# EAGLE design untitled (EAGLE 6.3)
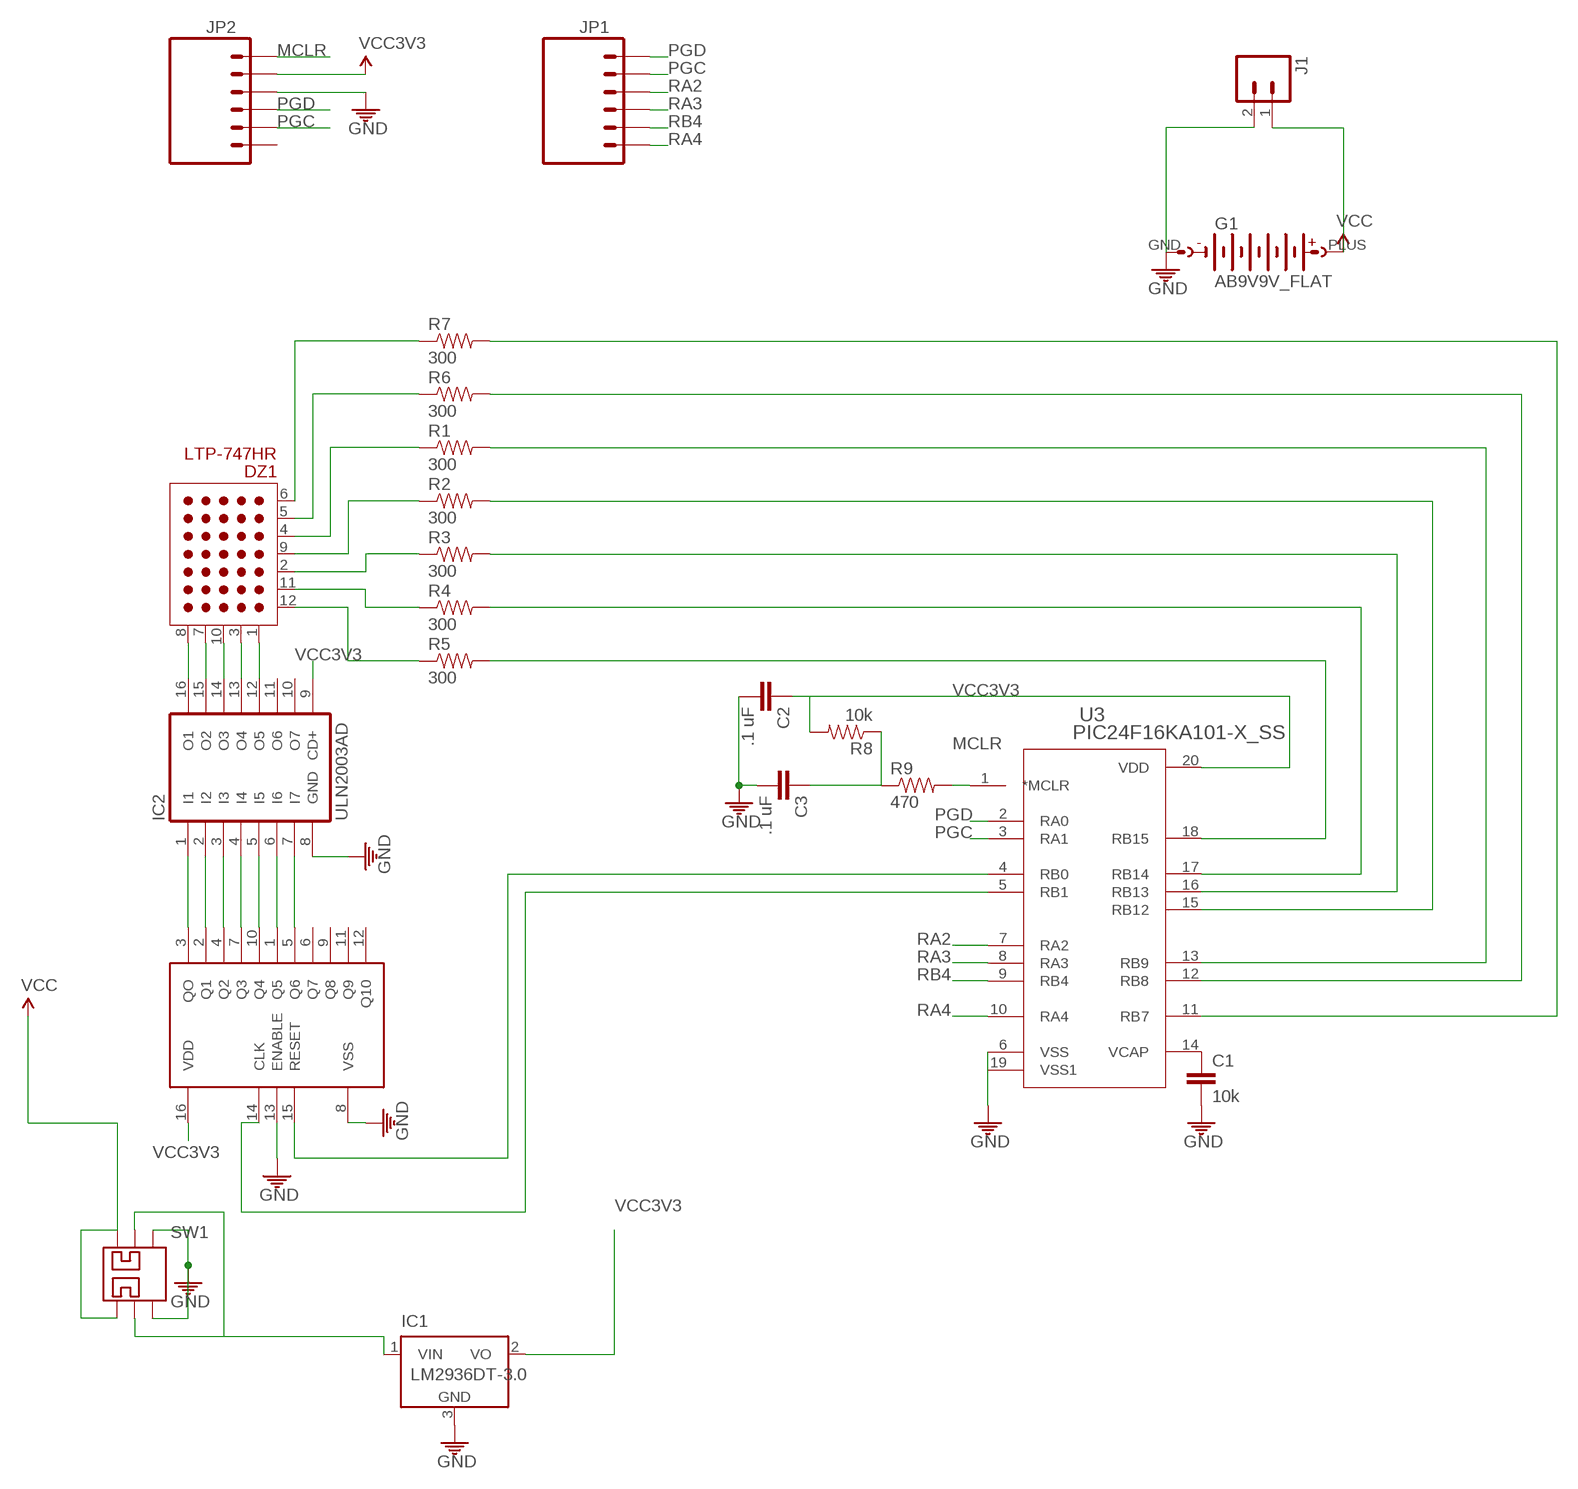
[diagram p0: schematic, sheet 1]

## Parts
C1  10k  CAP1206  [1206]
C2  .1 uF  CAP1206  [1206]
C3  .1 uF  CAP1206  [1206]
DZ1  LTP-747HR  [LTP-747HR]
G1  AB9V9V_FLAT  [BH9VPC]
IC1  LM2936DT-3.0  [TO252]
IC2  ULN2003AD  [SO16]
J1  M02PTH  [1X02]
JP1  M06LOCK  [1X06_LOCK]
JP2  M06LOCK  [1X06_LOCK]
R1  300  RESISTOR0805-RES  [0805]
R2  300  RESISTOR0805-RES  [0805]
R3  300  RESISTOR0805-RES  [0805]
R4  300  RESISTOR0805-RES  [0805]
R5  300  RESISTOR0805-RES  [0805]
R6  300  RESISTOR0805-RES  [0805]
R7  300  RESISTOR0805-RES  [0805]
R8  10k  RESISTOR0805-RES  [0805]
R9  470  RESISTOR0805-RES  [0805]
SW1  SLIDE_SWITCH_DPDTTOP  [EG2207]
U1  MC14017B  [SO16]
U3  PIC24F16KA101-X_SS  [SSOP20_MC]

## Nets
GND: C1.2 C2.2 C3.2 G1.GND(-) IC1.3(GND) IC2.8(GND) J1.2 JP2.3 SW1.P$3 SW1.P$6 U1.8(VSS) U1.13(ENABLE) U3.6(VSS) U3.19(VSS1)
MCLR: JP2.1 R9.2 U3.1(*MCLR)
N$1: DZ1.8(C5) IC2.16(O1)
N$2: DZ1.7(C4) IC2.15(O2)
N$3: DZ1.10(C3) IC2.14(O3)
N$4: DZ1.3(C2) IC2.13(O4)
N$5: DZ1.1(C1) IC2.12(O5)
N$6: IC2.1(I1) U1.3(QO)
N$7: IC2.2(I2) U1.2(Q1)
N$8: IC2.3(I3) U1.4(Q2)
N$9: IC2.4(I4) U1.7(Q3)
N$10: IC2.5(I5) U1.10(Q4)
N$11: IC2.6(I6) U1.1(Q5)
N$12: IC2.7(I7) U1.5(Q6)
N$13: U1.15(RESET) U3.4(RB0)
N$14: U1.14(CLK) U3.5(RB1)
N$16: DZ1.6(R7) R7.1
N$17: C1.1 U3.14(VCAP)
N$18: DZ1.5(R6) R6.1
N$19: DZ1.4(R5) R1.1
N$20: DZ1.9(R4) R2.1
N$21: DZ1.2(R3) R3.1
N$22: DZ1.11(R2) R4.1
N$23: DZ1.12(R1) R5.1
N$24: IC1.1(VIN) SW1.P$2 SW1.P$5
N$25: R5.2 U3.18(RB15)
N$26: R4.2 U3.17(RB14)
N$27: R3.2 U3.16(RB13)
N$28: R2.2 U3.15(RB12)
N$29: R1.2 U3.13(RB9)
N$30: R6.2 U3.12(RB8)
N$31: R7.2 U3.11(RB7)
N$32: C3.1 R8.1 R9.1
PGC: JP1.2 JP2.5 U3.3(RA1)
PGD [small]: JP1.1 JP2.4 U3.2(RA0)
RA2: JP1.3 U3.7(RA2)
RA3: JP1.4 U3.8(RA3)
RA4: JP1.6 U3.10(RA4)
RB4: JP1.5 U3.9(RB4)
VCC: G1.PLUS(+) J1.1 SW1.P$1 SW1.P$4
VCC3V3 [power]: C2.1 IC1.2(VO) IC2.9(CD+) JP2.2 R8.2 U1.16(VDD) U3.20(VDD)
Unconnected: IC2.10(O7) IC2.11(O6) JP2.6 U1.6(Q7) U1.9(Q8) U1.11(Q9) U1.12(Q10)

## Library data of the parts
C1-C3 = ASL:CAP: Capacitor Standard 0603 ceramic capacitor, and 0.1" leaded capacitor.
DZ1 = ledmatrix:LTP-747HR: 5x7 Dot Matrix LED Display
G1 = ASL:AB9V: 9-V BATTERY CLIP
IC1 = national-semiconductor:LM2936?*: Ultra-Low Quiescent Current LDO Voltage Regulator Source: Data sheet <http://www.national.com/ds/LM/LM2936.pdf>; MF: NATIONAL SEMICONDUCTOR; MPN: LM2936DT-3.0; OC_FARNELL: 1286862; OC_NEWARK: 74C4101
IC2 = uln-udn:ULN2003A: DRIVER ARRAY
J1 = ASL:M02: Header 2 Standard 2-pin 0.1" header. Use with straight break away headers (SKU : PRT-00116), right angle break away headers (PRT-00553), swiss pins (PRT-00743), machine pins (PRT-00117), and female headers (PRT-00115). Molex polarized connector foot print use with SKU : PRT-08233 with associated crimp pins and housings.
JP1 JP2 = CMPE118lib:M06: Header 6 Standard 6-pin 0.1" header. Use with straight break away headers (SKU : PRT-00116), right angle break away headers (PRT-00553), swiss pins (PRT-00743), machine pins (PRT-00117), and female headers (PRT-00115). Molex polarized connector foot print use with SKU : PRT-08094 with associated crimp pins and housings. NOTES ON THE VARIANTS LOCK and LOCK_LONGPADS... This footprint was designed to help hold the alignment of a through-hole component (i.e. 6-pin header) while soldering it into place. You may notice that each hole has been shifted either up or down by 0.005 of an inch from it's more standard position (which is a perfectly straight line). This slight alteration caused the pins (the squares in the middle) to touch the edges of the holes. Because they are alternating, it causes a "brace" to hold the component in place. 0.005 has proven to be the perfect amount of "off-center" position when using our standard breakaway headers. Although looks a little odd when you look at the bare footprint, once you have a header in there, the alteration is very hard to notice. Also, if you push a header all the way into place, it is covered up entirely on the bottom side. This idea of altering the position of holes to aid alignment will be further integrated into the Sparkfun Library for other footprints. It can help hold any component with 3 or more connection pins.
R1-R9 = ASL:RESISTOR: Resistor Basic schematic elements and footprints for 0603, 1206, and PTH resistors.
SW1 = ASL:SLIDE_SWITCH_DPDT
U1 = BadgeStuff:MC14017B
U3 = BadgeStuff:PIC24F16KA101-X_SS

## Net classes
0 default: width 0.406 mm
1 power: width 0.762 mm, clearance 0.254 mm to class 0, clearance 0.508 mm
2 small: width 0.254 mm, clearance 0.254 mm to class 1

## Board
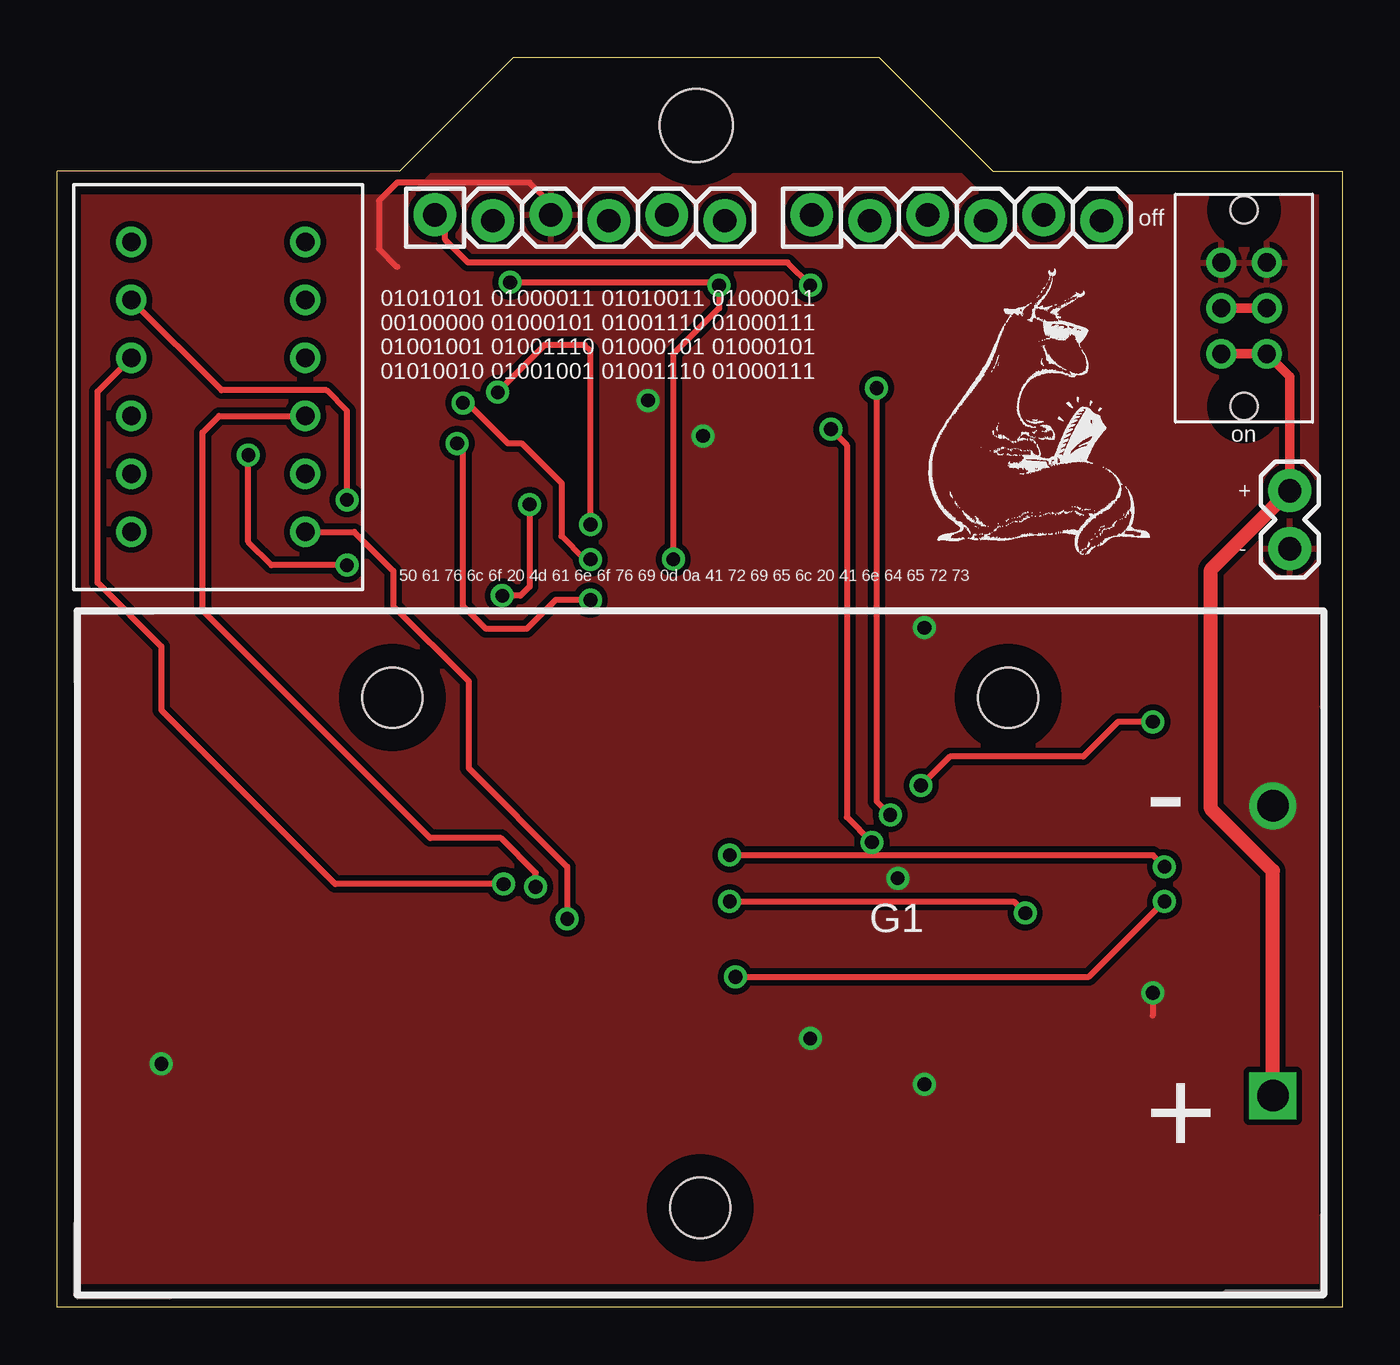
[diagram p1: board, top side]
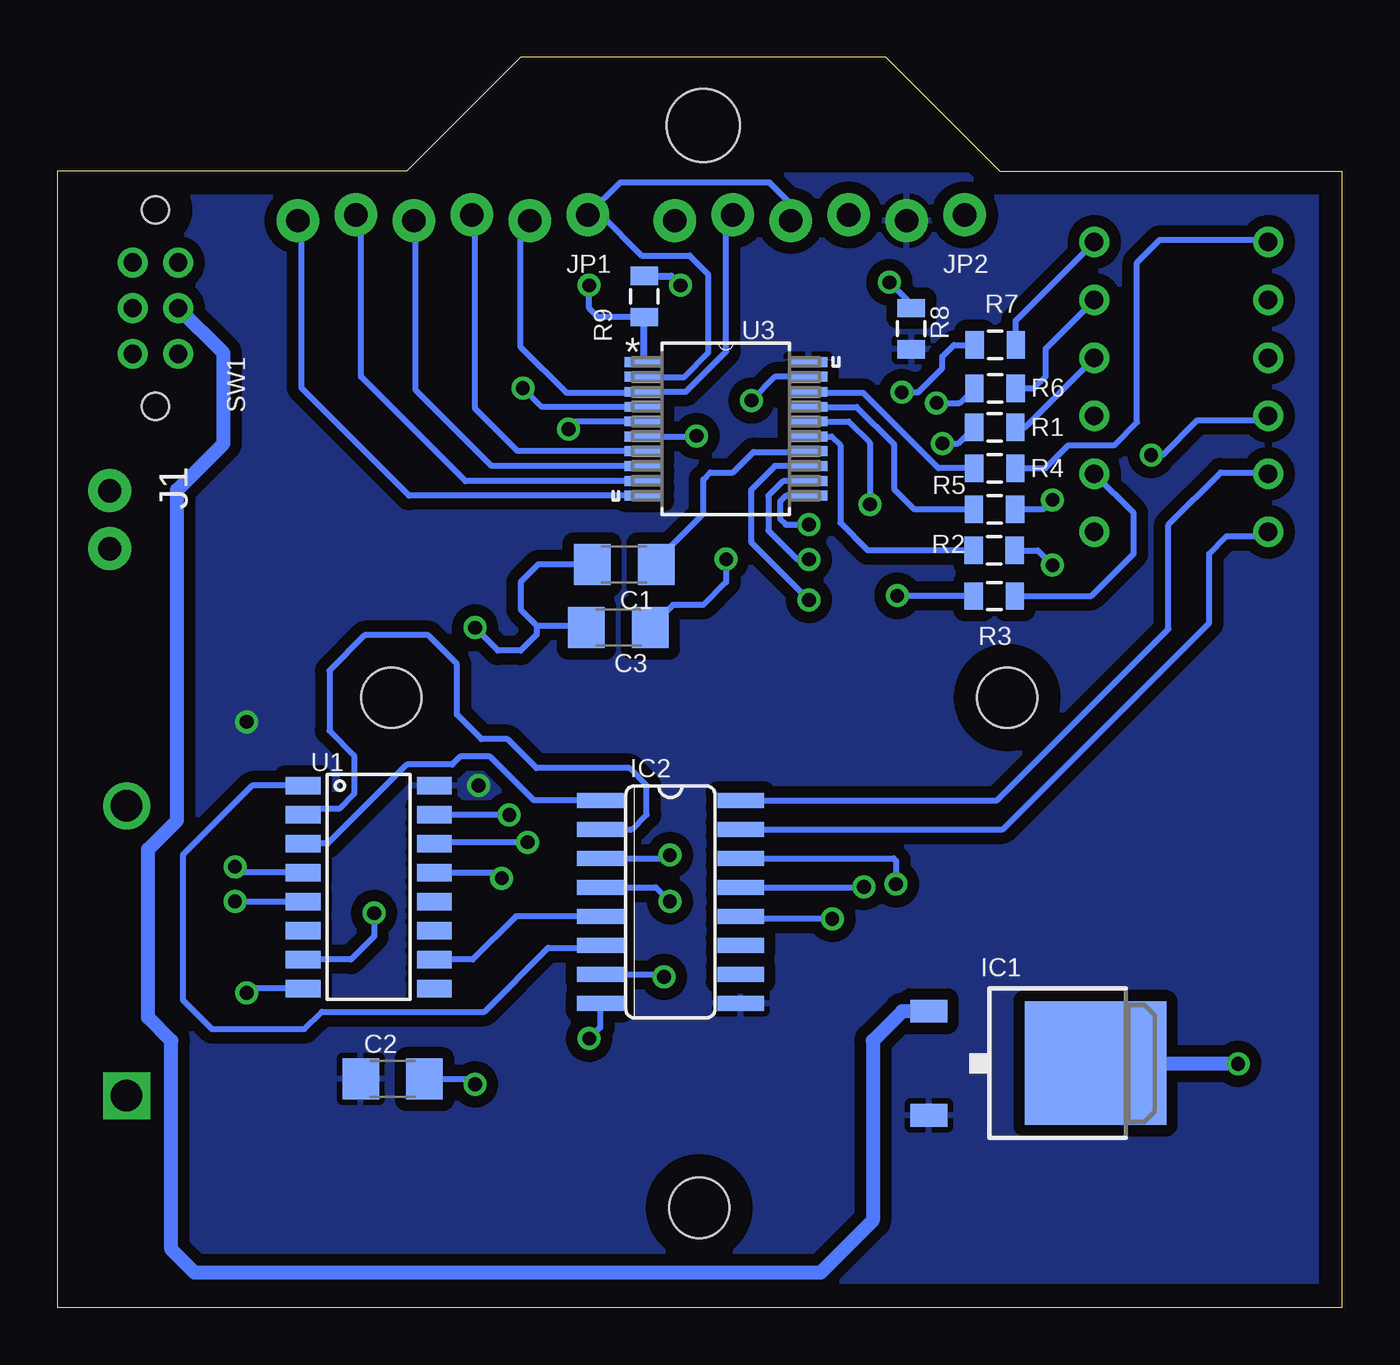
[diagram p2: board, bottom side, seen from below]

Size 56.31 x 54.78 mm. Coordinates in mm from the lower left corner, seen from the top.
Outline: 15,49.78 20,54.78 36,54.78 41,49.78 56.31,49.78 56.31,0 0,0 0,49.78 15,49.78
Copper layers (1*16): Top 0.035mm / dielectric 1.5mm / Bottom 0.035mm
Design rules "default": minimum track width 10mil, minimum drill 24mil, track to track 8mil, track to pad 8mil, pad to pad 8mil, via to via 8mil, smd to smd 8mil, copper to edge 40mil, drill to drill 8mil, minimum pad ring 10mil, minimum via ring 8mil, stop-mask expansion 4mil, vias tented up to drill 0mil, thermal gap 10mil
Holes 3.2 mm at 28,51.78

### Footprints (pad centres in the part's own frame; a part is rotated, then mirrored left to right if it is on the bottom)
1206 = smd 1.6 x 1.8: 1 -1.4,0; 2 1.4,0
LTP-747HR = drill 0.813: 1 -3.81,6.35; 2 -3.81,3.81; 3 -3.81,1.27; 4 -3.81,-1.27; 5 -3.81,-3.81; 6 -3.81,-6.35; 7 3.81,6.35; 8 3.81,3.81; 9 3.81,1.27; 10 3.81,-1.27; 11 3.81,-3.81; 12 3.81,-6.35
BH9VPC = drill 1.372: GND 24.3,5.42 | drill 1.372 square: PLUS 24.3,-7.28 | hole 2.642: 12.7,10.16; -14.275,10.16; -0.787,-12.192
TO252 = smd 1 x 1.6: 1 -2.28,-4.8; 2 2.28,-4.8 | smd 5.4 x 6.2: 3 0,2.5
SO16 = smd 0.66 x 2.032: 1 -4.445,-3.073; 2 -3.175,-3.073; 3 -1.905,-3.073; 4 -0.635,-3.073; 5 0.635,-3.073; 6 1.905,-3.073; 7 3.175,-3.073; 8 4.445,-3.073; 9 4.445,3.073; 10 3.175,3.073; 11 1.905,3.073; 12 0.635,3.073; 13 -0.635,3.073; 14 -1.905,3.073; 15 -3.175,3.073; 16 -4.445,3.073
1X02 = drill 1.016 pad 1.88: 1 0,0; 2 2.54,0
1X06_LOCK = drill 1.016 pad 1.88: 1 0,0.127; 2 2.54,-0.127; 3 5.08,0.127; 4 7.62,-0.127; 5 10.16,0.127; 6 12.7,-0.127
0805 = smd 0.8 x 1.2: 1 -0.9,0; 2 0.9,0
EG2207 = drill 0.8: P$1 -2,1; P$2 0,1; P$3 2,1; P$4 -2,-1; P$5 0,-1; P$6 2,-1 | hole 1.2: 4.3,0; -4.3,0
SO16' = smd 0.762 x 1.524: 1 -4.445,-2.875; 2 -3.175,-2.875; 3 -1.905,-2.875; 4 -0.635,-2.875; 5 0.635,-2.875; 6 1.905,-2.875; 7 3.175,-2.875; 8 4.445,-2.875; 9 4.445,2.875; 10 3.175,2.875; 11 1.905,2.875; 12 0.635,2.875; 13 -0.635,2.875; 14 -1.905,2.875; 15 -3.175,2.875; 16 -4.445,2.875
SSOP20_MC = smd 1.676 x 0.432: 1 -3.607,2.921; 2 -3.607,2.286; 3 -3.607,1.626; 4 -3.607,0.965; 5 -3.607,0.33; 6 -3.607,-0.33; 7 -3.607,-0.965; 8 -3.607,-1.626; 9 -3.607,-2.286; 10 -3.607,-2.921; 11 3.607,-2.921; 12 3.607,-2.286; 13 3.607,-1.626; 14 3.607,-0.965; 15 3.607,-0.33; 16 3.607,0.33; 17 3.607,0.965; 18 3.607,1.626; 19 3.607,2.286; 20 3.607,2.921

### Placement (x,y rotation side)
C1  31.47,32.55 180 bottom
C2  41.61,10.01 0 bottom
C3  31.72,29.79 180 bottom
DZ1  7.06,40.33 180 top
G1  28.97,16.56 0 top
IC1  13.32,10.7 270 bottom
IC2  29.44,17.77 270 bottom
J1  54,35.78 270 top
JP1  33.06,47.74 0 top
JP2  16.55,47.74 0 top
R1  15.23,38.55 180 bottom
R2  15.26,33.17 180 bottom
R3  15.25,31.17 180 bottom
R4  15.24,34.97 180 bottom
R5  15.23,36.77 180 bottom
R6  15.22,40.27 180 bottom
R7  15.21,42.17 180 bottom
R8  18.89,42.88 270 bottom
R9  30.59,44.29 270 bottom
SW1  52,43.78 90 top
U1  MC14017B  [SO16']  42.66,18.42 270 bottom
U3  27.01,38.49 0 bottom

### Tracks (layer width: path | path; a pad name or v marks a point on that pad's centre or on a via)
GND  (via drill 0.6)
  Top 0.254: JP2.3 21.63,48.35 20.7,49.28 14.9,49.28 14.1,48.48 14.1,46.38 14.9,45.58 | v48,13.78 48,12.78
  Bottom 0.254: U3.6 28.32,38.16 v28.3,38.18 | C1.2 35.23,32.55 36,31.78 36,30.58 35.3,29.88 | 35.3,29.88 33.21,29.88 C3.2 | 35.3,29.88 35.3,29.48 36,28.78 37,28.78 v38,29.78 | IC2.8 32.51,12.27 v33,11.78 | C2.2 38.23,10.01 v38,9.78 | U1.8 47.8,13.98 v48,13.78 | U1.13 37.08,19.05 v36.83,18.8 | U3.19 24.85,40.78 v25.89,39.74
  Bottom 0.61: IC1.3 4.6,10.7 v4.57,10.67
  pour Top (isolate 0.254): 0.6,49.58 55.7,49.58 55.7,0.78 0.6,0.78
MCLR  (via drill 0.6)
  Top 0.254: v33,44.78 32,45.78 18,45.78 17,46.78 17,47.42 JP2.1
  Bottom 0.254: R9.2 32.61,43.39 33,43.78 v33,44.78
  Bottom 0.305: U3.1 30.59,41.41 R9.2
N$1
  Bottom 0.254: IC2.16 15.13,22.22 7.62,29.72 7.62,34.3 5.33,36.58 3.31,36.58 DZ1.8
N$2
  Bottom 0.254: IC2.15 14.88,20.95 5.84,29.98 5.84,33.03 5.08,33.79 3.44,33.79 DZ1.7
N$3  (via drill 0.6)
  Top 0.254: v19.56,18.55 12.19,18.55 4.57,26.17 4.57,28.96 1.78,31.76 1.78,40.13 DZ1.10
  Bottom 0.254: IC2.14 19.67,19.68 19.56,19.56 v19.56,18.55
N$4  (via drill 0.6)
  Top 0.254: v20.96,18.43 20.96,19.04 19.44,20.56 16.34,20.56 6.38,30.53 6.38,38.34 7.1,39.06 DZ1.3
  Bottom 0.254: IC2.13 20.96,18.41 v20.96,18.43
N$5  (via drill 0.6)
  Top 0.254: DZ1.1 13.02,33.98 14.73,32.26 14.73,30.74 18.03,27.44 18.03,23.63 22.35,19.31 v22.35,17.02
  Bottom 0.254: v22.35,17.02 26.26,17.02 IC2.12
N$6
  Bottom 0.254: IC2.1 35.42,22.22 37.34,24.14 38.64,24.14 39,23.78 41,23.78 44.45,20.33 U1.3
N$7
  Bottom 0.254: IC2.2 31.13,20.95 30.48,21.6 30.48,22.87 31.24,23.63 35.31,23.63 36.58,24.9 37.72,24.9 38.79,25.97 38.79,28.19 40.05,29.45 42.83,29.45 44.38,27.9 44.38,25.27 43.3,24.19 43.3,22.49 43.94,21.85 45.28,21.85 U1.2
N$8  (via drill 0.6)
  Top 0.254: v29.46,19.82 47.5,19.82 48.01,19.82 v48.51,19.31
  Bottom 0.254: IC2.3 29.61,19.68 v29.46,19.82 | U1.4 48.26,19.06 v48.51,19.31
N$9  (via drill 0.6)
  Top 0.254: v29.46,17.79 41.91,17.79 v42.42,17.28
  Bottom 0.254: IC2.4 30.08,18.41 v29.46,17.79 | v42.42,17.28 42.42,16.26 43.43,15.25 U1.7
N$10
  Bottom 0.254: IC2.5 36.21,17.13 38.1,15.25 U1.10
N$11
  Bottom 0.254: U1.1 47.75,22.87 50.8,19.82 50.8,13.47 49.53,12.2 45.47,12.2 44.7,12.96 37.59,12.96 34.8,15.75 32.62,15.75 IC2.6
N$12  (via drill 0.6)
  Top 0.254: v29.72,14.48 45.21,14.48 v48.51,17.79
  Bottom 0.254: IC2.7 29.83,14.59 v29.72,14.48 | v48.51,17.79 U1.5
N$13  (via drill 0.6)
  Top 0.254: v35.9,40.28 35.9,22.18 v36.5,21.58
  Bottom 0.254: U3.4 35.08,39.45 v35.9,40.28 | v36.5,21.58 U1.15
N$14  (via drill 0.6)
  Top 0.254: v33.9,38.48 34.6,37.78 34.6,21.48 v35.7,20.38
  Bottom 0.254: U3.5 33.56,38.82 v33.9,38.48 | v35.7,20.38 39.73,20.38 U1.14
N$16
  Bottom 0.254: R7.1 14.31,43.24 DZ1.6
N$17
  Bottom 0.254: C1.1 30.07,32.71 28,34.78 28,36.28 27.7,36.58 26.7,36.58 25.8,37.48 23.45,37.48 U3.14
N$18
  Bottom 0.254: R6.1 13.51,40.27 13,40.78 13,42.01 DZ1.5
N$19
  Bottom 0.254: R1.1 13.92,38.55 DZ1.4
N$20  (via drill 0.6)
  Top 0.254: v12.7,32.52 9.4,32.52 8.38,33.53 v8.38,37.34
  Bottom 0.254: R2.1 13.35,33.17 v12.7,32.52 | v8.38,37.34 7.87,37.34 6.35,38.87 3.44,38.87 DZ1.9
N$21
  Bottom 0.254: R3.1 11,31.17 9.14,33.03 9.14,34.79 DZ1.2
N$22  (via drill 0.6)
  Top 0.254: v12.7,35.38 12.7,39.28 11.8,40.18 7.21,40.18 DZ1.11
  Bottom 0.254: R4.1 13.11,34.97 v12.7,35.38
N$23
  Bottom 0.254: R5.1 13.01,36.77 12,37.78 10,37.78 9,38.78 9,45.78 8,46.78 3.35,46.78 DZ1.12
N$24
  Top 0.406: SW1.P$5 SW1.P$2
  Bottom 0.61: IC1.1 19.28,12.98 20.57,11.69 20.57,3.82 22.86,1.53 50.29,1.53 51.31,2.55 51.31,11.69 52.32,12.71 52.32,20.07 51.05,21.34 51.05,35.82 49.02,37.85 49.02,41.8 SW1.P$2
N$25
  Bottom 0.254: R5.2 17.69,36.77 21,40.08 23.37,40.08 U3.18
N$26
  Bottom 0.254: R4.2 18.77,34.98 19.65,35.86 19.65,37.82 21.28,39.45 U3.17
N$27  (via drill 0.6)
  Top 0.254: v20.7,35.18 20.7,31.58 20.3,31.18 v19.5,31.18
  Bottom 0.254: U3.16 21.64,38.82 20.7,37.88 v20.7,35.18 | v19.5,31.18 R3.2
N$28
  Bottom 0.254: U3.15 22.38,38.16 22,37.78 22,34.38 20.8,33.18 R2.2
N$29  (via drill 0.6)
  Top 0.254: v23.37,30.99 21.84,30.99 20.57,29.72 18.8,29.72 17.78,30.74 17.78,37.6 v17.53,37.85
  Bottom 0.254: U3.13 24.86,36.86 25.91,35.82 25.91,33.53 v23.37,30.99 | v17.53,37.85 16.83,37.85 R1.2
N$30  (via drill 0.6)
  Top 0.254: v23.37,32.77 23.11,32.77 22.1,33.79 22.11,33.8 22.11,36.11 20.34,37.87 19.74,37.87 17.98,39.63 v17.78,39.63
  Bottom 0.254: U3.12 24.51,36.2 25.15,35.57 25.15,34.04 23.88,32.77 v23.37,32.77 | v17.78,39.63 16.76,39.63 R6.2
N$31  (via drill 0.6)
  Top 0.254: v23.37,34.3 23.37,41.92 23.11,42.17 21.34,42.17 21.34,42.13 v19.3,40.1
  Bottom 0.254: U3.11 24.38,35.57 24.64,35.31 24.64,34.55 24.38,34.3 v23.37,34.3 | R7.2 17.02,42.17 17.53,41.66 17.53,41.15 18.58,40.1 v19.3,40.1
N$32  (via drill 0.6)
  Top 0.254: v27,32.78 27,41.78 29,43.78 v29,44.78 28.87,44.91 v19.85,44.91
  Bottom 0.254: v27,32.78 27,31.78 28,30.78 29.33,30.78 C3.1 | R8.1 18.89,43.96 v19.85,44.91
  Bottom 0.305: R9.1 29.41,45.19 v29,44.78
PGC
  Bottom 0.254: JP2.5 27,47.58 27,41.88 28.76,40.12 U3.3 30.65,40.08 34,40.08 36,42.08 36,47.21 JP1.2
PGD
  Bottom 0.254: JP2.4 24.17,48.35 25.1,49.28 31.65,49.28 JP1.1 32.49,47.87 30.7,46.08 28.6,46.08 27.8,45.28 27.8,41.8 28.85,40.75 29.77,40.75 29.8,40.78 U3.2
RA2
  Bottom 0.254: U3.7 36.15,37.53 38,39.38 38,47.73 JP1.3
RA3
  Bottom 0.254: U3.8 37.28,36.86 40.6,40.18 40.6,47.53 JP1.4
RA4
  Bottom 0.254: U3.10 40.89,35.57 45.6,40.28 45.6,47.45 JP1.6
RB4
  Bottom 0.254: U3.9 38.42,36.2 43,40.78 43,47.65 JP1.5
VCC
  Top 0.406: J1.1 54,40.78 SW1.P$4 SW1.P$1
  Top 0.61: G1.PLUS 53.27,19.13 50.55,21.85 50.55,32.33 J1.1
VCC3V3  (via drill 0.6)
  Top 0.254: v48.01,25.66 46.48,25.66 44.96,24.14 39.12,24.14 v37.85,22.87
  pour Bottom (isolate 0.305): 0.3,49.58 55.7,49.58 55.7,0.78 0.3,0.78

### Text on the board
tNames: off | 01010101 01000011 01010011 01000011 / 00100000 01000101 01001110 01000111 / 01001001 01001110 01000101 01000101 / 01010010 01001001 01001110 01000111 | on | + | - | 50 61 76 6c 6f 20 4d 61 6e 6f 76 69 0d 0a 41 72 69 65 6c 20 41 6e 64 65 72 73